# Altium schematic sheet Power Supply (Switching).SchDoc
size A4
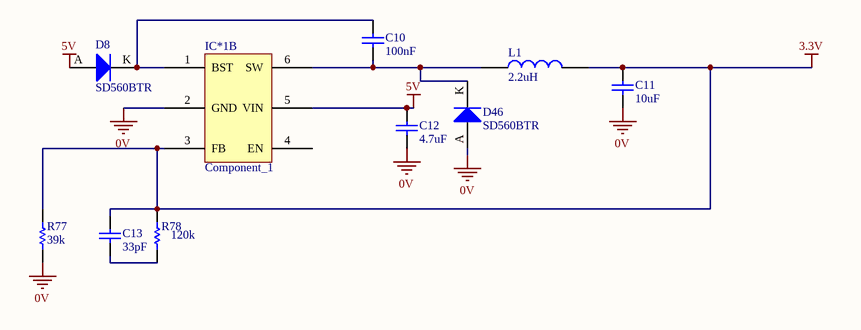
[diagram p0: Power Supply (Switching).SchDoc]

## Parts
C10  100nF  [0805]
C11  10uF  [0805]
C12  4.7uF  [0805]
C13  33pF  [0805]
D8  SD560BTR  [SMB Diode]
D46  SD560BTR  [SMB Diode]
IC*1  Component_1  [MP2451 SOT23-6]  (part B of 2)
L1  2.2uH  [1210]
R77  39k  [0805]
R78  120k  [0805]

## Nets
0V: C11.1 C12.1 D46.A IC*1.2(GND) R77.1
3.3V: C11.2 C13.2 IC*1.3(FB) L1.1 R77.2 R78.2
5V: C12.2 D8.A IC*1.5(VIN)
NetC10_1: C10.1 D8.K IC*1.1(BST)
NetC10_2: C10.2 D46.K IC*1.6(SW) L1.2
NetC13_1: C13.1 R78.1

Not connected (* = marked no-connect by the designer): IC*1 4(EN)

## Library data of the parts
C10 = GCM21BR71E104KA37L: Manufacturer: muRata; Tolerance: 10%; Material: X7R; Rated Voltage: 25V; Part Number: GCM21BR71E104KA37L; Value: 100nF
C11 = GCM21BR61A106KA37L: Manufacturer: muRata; Tolerance: 10%; Material: X5R; Rated Voltage: 10V; Part Number: GCM21BR61A106KA37L; Value: 10uF
C12 = GCM21BR61A475KA37L: Manufacturer: muRata; Tolerance: 10%; Material: X5R; Rated Voltage: 10V; Part Number: GCM21BR61A475KA37L; Value: 4.7uF
C13 = GCM21B5C1H330JA37L: Manufacturer: muRata; Tolerance: 5%; Material: C0G; Rated Voltage: 50V; Part Number: GCM21B5C1H330JA37L; Value: 33pF
D8 D46 = SD560BTR: 1.2V_F 600V 5A SMB; Manufacturer: SMC Diode Solutions; Part Number: SD560BTR; Digikey Part Number: 1655-1530-2-ND; Digikey Link: https://www.digikey.com/product-detail/en/smc-diode-solutions/SD560BTR/1655-1530-2-ND/6022620
IC*1 = Component_1: MP2451
L1 = LQH32PN2R2NN0L: Manufacturer: Murata; Tolerance: 0.3; Rated Current: 1.55A; Part Number: LQH32PN2R2NN0L; Value: 2.2uH; Digikey Part Number: 490-5336-1-ND
R77 = RC0805FR0739KL: Manufacturer: YAGEO; Tolerance: 0.01; Rated Voltage: 0.125W; Part Number: RC0805FR0739KL; Value: 39k; Material: FR-07; qty: 50
R78 = RC0805FR07120KL: Manufacturer: YAGEO; Tolerance: 0.01; Rated Voltage: 0.125W; Part Number: RC0805FR07120KL; Value: 120k; Material: FR-07; qty: 50